# Altium schematic sheet S6_Solenoid_Valve_Interlock.SchDoc: Solenoid Valve Interlock
size Tabloid; DrawnBy: Dhrumil Parikh; SheetNumber: 6; SheetTotal: 6; PageSetup: Record=PageOptions|CenterHorizontal=True|CenterVertical=True|PrintScale=0.62|XCorrection=1.00|YCorrection=1.00|PrintKind=1|BorderSize=5000000|LeftOffset=0|BottomOffset=0|Orientation=2|PaperLength=1000|PaperWidth=1000|Scale=100|PaperSource=7|PrintQuality=600|MediaType=1|DitherType=10|PaperKind=Letter|PrintScaleMode=1; PageSize: T
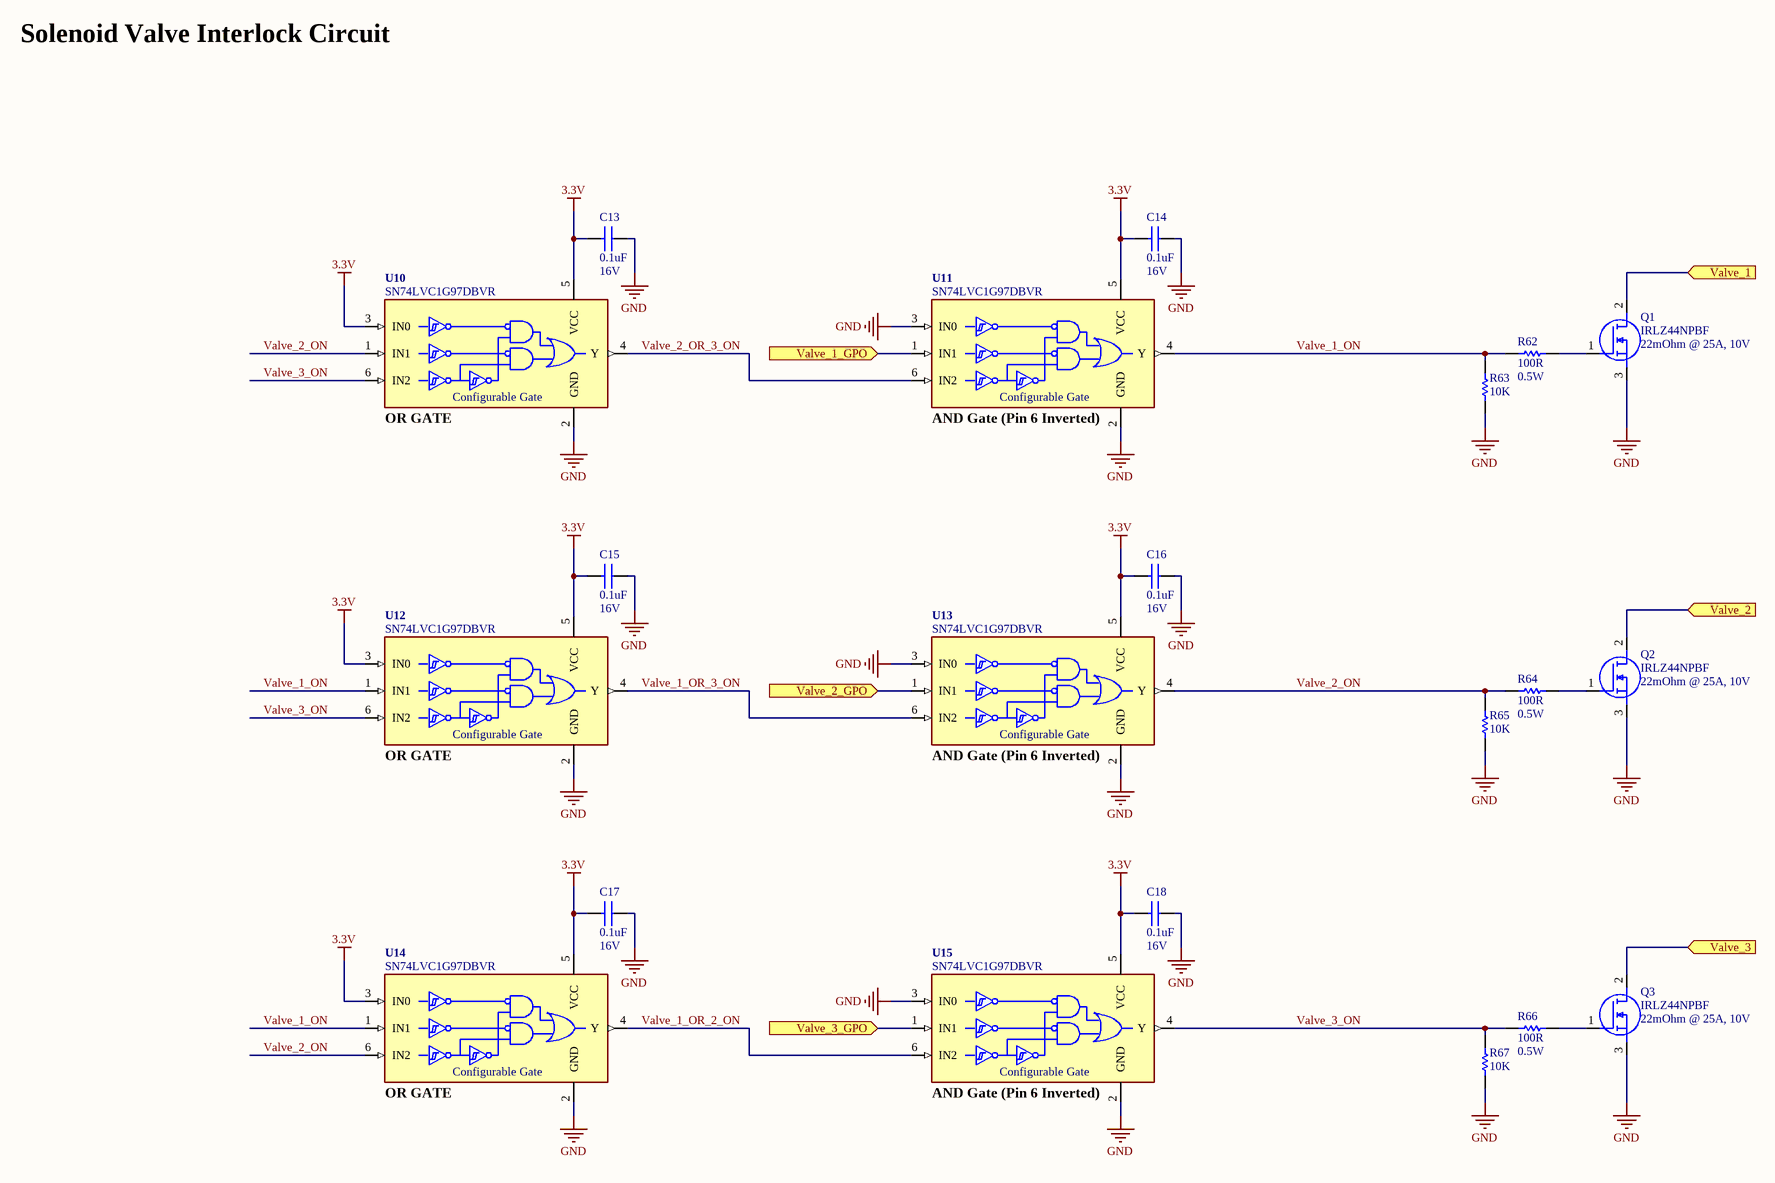
[diagram p0: S6_Solenoid_Valve_Interlock.SchDoc]

## Parts
C13  value 0.1uF  VOLTAGE: 16V  [CAPC1608X09N]  (hidden comment: CAP CER 0.1UF 16V X7R 0603)
C14  value 0.1uF  VOLTAGE: 16V  [CAPC1608X09N]  (hidden comment: CAP CER 0.1UF 16V X7R 0603)
C15  value 0.1uF  VOLTAGE: 16V  [CAPC1608X09N]  (hidden comment: CAP CER 0.1UF 16V X7R 0603)
C16  value 0.1uF  VOLTAGE: 16V  [CAPC1608X09N]  (hidden comment: CAP CER 0.1UF 16V X7R 0603)
C17  value 0.1uF  VOLTAGE: 16V  [CAPC1608X09N]  (hidden comment: CAP CER 0.1UF 16V X7R 0603)
C18  value 0.1uF  VOLTAGE: 16V  [CAPC1608X09N]  (hidden comment: CAP CER 0.1UF 16V X7R 0603)
Q1  value 22mOhm @ 25A, 10V  MFG_PART_NO: IRLZ44NPBF  [TO254P469X1042X1967-3P]  (hidden comment: MOSFET N-CH 55V 47A TO-220AB)
Q2  value 22mOhm @ 25A, 10V  MFG_PART_NO: IRLZ44NPBF  [TO254P469X1042X1967-3P]  (hidden comment: MOSFET N-CH 55V 47A TO-220AB)
Q3  value 22mOhm @ 25A, 10V  MFG_PART_NO: IRLZ44NPBF  [TO254P469X1042X1967-3P]  (hidden comment: MOSFET N-CH 55V 47A TO-220AB)
R62  value 100R  POWER: 0.5W  [RESC3116X06N]  (hidden comment: RES 100 OHM 1% 1/2W 1206)
R63  value 10K  [RESC1608X06N]  (hidden comment: RES SMD 10K OHM 1% 1/10W 0603)
R64  value 100R  POWER: 0.5W  [RESC3116X06N]  (hidden comment: RES 100 OHM 1% 1/2W 1206)
R65  value 10K  [RESC1608X06N]  (hidden comment: RES SMD 10K OHM 1% 1/10W 0603)
R66  value 100R  POWER: 0.5W  [RESC3116X06N]  (hidden comment: RES 100 OHM 1% 1/2W 1206)
R67  value 10K  [RESC1608X06N]  (hidden comment: RES SMD 10K OHM 1% 1/10W 0603)
U10  value SN74LVC1G97DBVR  [SOT65P210X110-6N_SN74LVC1G97DCK]  (hidden comment: IC CONFIG MULT-FUNC GATE SOT23-6)
U11  value SN74LVC1G97DBVR  [SOT65P210X110-6N_SN74LVC1G97DCK]  (hidden comment: IC CONFIG MULT-FUNC GATE SOT23-6)
U12  value SN74LVC1G97DBVR  [SOT65P210X110-6N_SN74LVC1G97DCK]  (hidden comment: IC CONFIG MULT-FUNC GATE SOT23-6)
U13  value SN74LVC1G97DBVR  [SOT65P210X110-6N_SN74LVC1G97DCK]  (hidden comment: IC CONFIG MULT-FUNC GATE SOT23-6)
U14  value SN74LVC1G97DBVR  [SOT65P210X110-6N_SN74LVC1G97DCK]  (hidden comment: IC CONFIG MULT-FUNC GATE SOT23-6)
U15  value SN74LVC1G97DBVR  [SOT65P210X110-6N_SN74LVC1G97DCK]  (hidden comment: IC CONFIG MULT-FUNC GATE SOT23-6)

## Ports
Valve_1 (in), Valve_1_GPO (in), Valve_2 (in), Valve_2_GPO (in), Valve_3 (in), Valve_3_GPO (in)

## Nets
3.3V: C13.2 C14.2 C15.2 C16.2 C17.2 C18.2 U10.3(IN0) U10.5(VCC) U11.5(VCC) U12.3(IN0) U12.5(VCC) U13.5(VCC) U14.3(IN0) U14.5(VCC) U15.5(VCC)
GND: C13.1 C14.1 C15.1 C16.1 C17.1 C18.1 Q1.3(S) Q2.3(S) Q3.3(S) R63.1 R65.1 R67.1 U10.2(GND) U11.2(GND) U11.3(IN0) U12.2(GND) U13.2(GND) U13.3(IN0) U14.2(GND) U15.2(GND) U15.3(IN0)
Valve_1: Q1.2(D) ; port Valve_1
Valve_1_GPO: U11.1(IN1) ; port Valve_1_GPO
Valve_1_ON: R62.1 R63.2 U11.4(Y) U12.1(IN1) U14.1(IN1)
Valve_1_OR_2_ON: U14.4(Y) U15.6(IN2)
Valve_1_OR_3_ON: U12.4(Y) U13.6(IN2)
Valve_2: Q2.2(D) ; port Valve_2
Valve_2_GPO: U13.1(IN1) ; port Valve_2_GPO
Valve_2_ON: R64.1 R65.2 U10.1(IN1) U13.4(Y) U14.6(IN2)
Valve_2_OR_3_ON: U10.4(Y) U11.6(IN2)
Valve_3: Q3.2(D) ; port Valve_3
Valve_3_GPO: U15.1(IN1) ; port Valve_3_GPO
Valve_3_ON: R66.1 R67.2 U10.6(IN2) U12.6(IN2) U15.4(Y)
NetQ1_1: Q1.1(G) R62.2
NetQ2_1: Q2.1(G) R64.2
NetQ3_1: Q3.1(G) R66.2

## Notes on the sheet
- Solenoid Valve Interlock Circuit
- (near U10) OR GATE
- (near U11) AND Gate (Pin 6 Inverted)
- (near U12) OR GATE
- (near U13) AND Gate (Pin 6 Inverted)
- (near U14) OR GATE
- (near U15) AND Gate (Pin 6 Inverted)
- Title:
- Project:
- Size:
- Date:
- DrawnBy:
- Rev:
- Project Lead:
- Sheet
- Dhrumil Parikh
- of
- 200 University Ave W
- Waterloo, ON
- N2L 3G1, Canada
- File:
- (in symbol IC CONFIG MULT-FUNC GATE SOT23-6) Configurable Gate

## Library data of the parts
C13-C18 = CAP CER 0.1UF 16V X7R 0603: MFG_PART_NO: C0603C104M4RACTU; MFG: KEMET; TOLERANCE: 20%; COST: 0.14; DIELECTRIC: X7R
Q1-Q3 = MOSFET N-CH 55V 47A TO-220AB: MFG: Infineon Technologies; COST: 1.47
R62 R64 R66 = RES 100 OHM 1% 1/2W 1206: MFG_PART_NO: RNCP1206FTD100R; MFG: Stackpole Electronics Inc; COST: 0.15; TOLERANCE: 1%
R63 R65 R67 = RES SMD 10K OHM 1% 1/10W 0603: MFG_PART_NO: CRCW060310K0FKEA; MFG: Vishay Dale; COST: 0.15; TOLERANCE: 1%
U10-U15 = IC CONFIG MULT-FUNC GATE SOT23-6: MFG: TI; COST: 0.58; MFG_PART_NO: SN74LVC1G97DBVR